# Altium schematic sheet LED_Power_Ind.SchDoc
size A
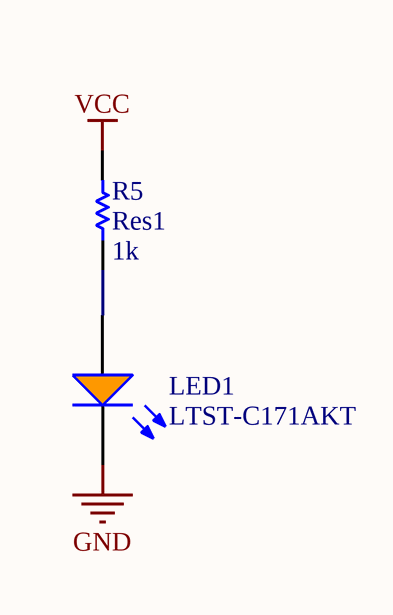
[diagram p0: LED_Power_Ind.SchDoc]

## Parts
LED1  LTST-C171AKT  [LTST-C171AKT_V]
R5  Res1  value 1k  [6-0805_L]

## Nets
GND: LED1.2(K)
VCC: R5.2
NetLED1_1: LED1.1(A) R5.1

## Library data of the parts
LED1 = CMP-1674-00004-5: LED Uni-Color Orange, 100 mW, 120 mA, -55 to 85 degC, 2-Pin SMD, RoHS, Tape and Reel; Manufacturer: Lite-On; ComponentLink1URL: http://www.us.liteon.com/; ComponentLink2Description: Datasheet; Packaging: Tape and Reel; Mount: Surface Mount; RoHSCompliant: true; Colour: Orange; Min Operating Temperature: -55 degC; ComponentLink2URL: http://optoelectronics.liteon.com/upload/download/DS-22-99-0170/S_110_LTST-C171AKT.pdf; Package Quantity: 3000; Height: 0.8 mm; Max Operating Temperature: 85 degC; ComponentLink1Description: Manufacturer URL; PackageReference: C171AKT; PackageDescription: 2-Pin Surface Mount Device, Body 2 x 1.25 mm; DatasheetVersion: 03/2014; Length: 2 mm; Mounting Technology: Surface Mount; Pins: 2
R5 = Res1: Resistor; Published: 8-Jun-2000; LatestRevisionDate: 17-Jul-2002; LatestRevisionNote: Re-released for DXP Platform.; PackageReference: AXIAL-0.3; Publisher: Altium Limited; PackageDescription: Axial Device, Thru-Hole; 2 Leads; 0.3 in Pin Spacing